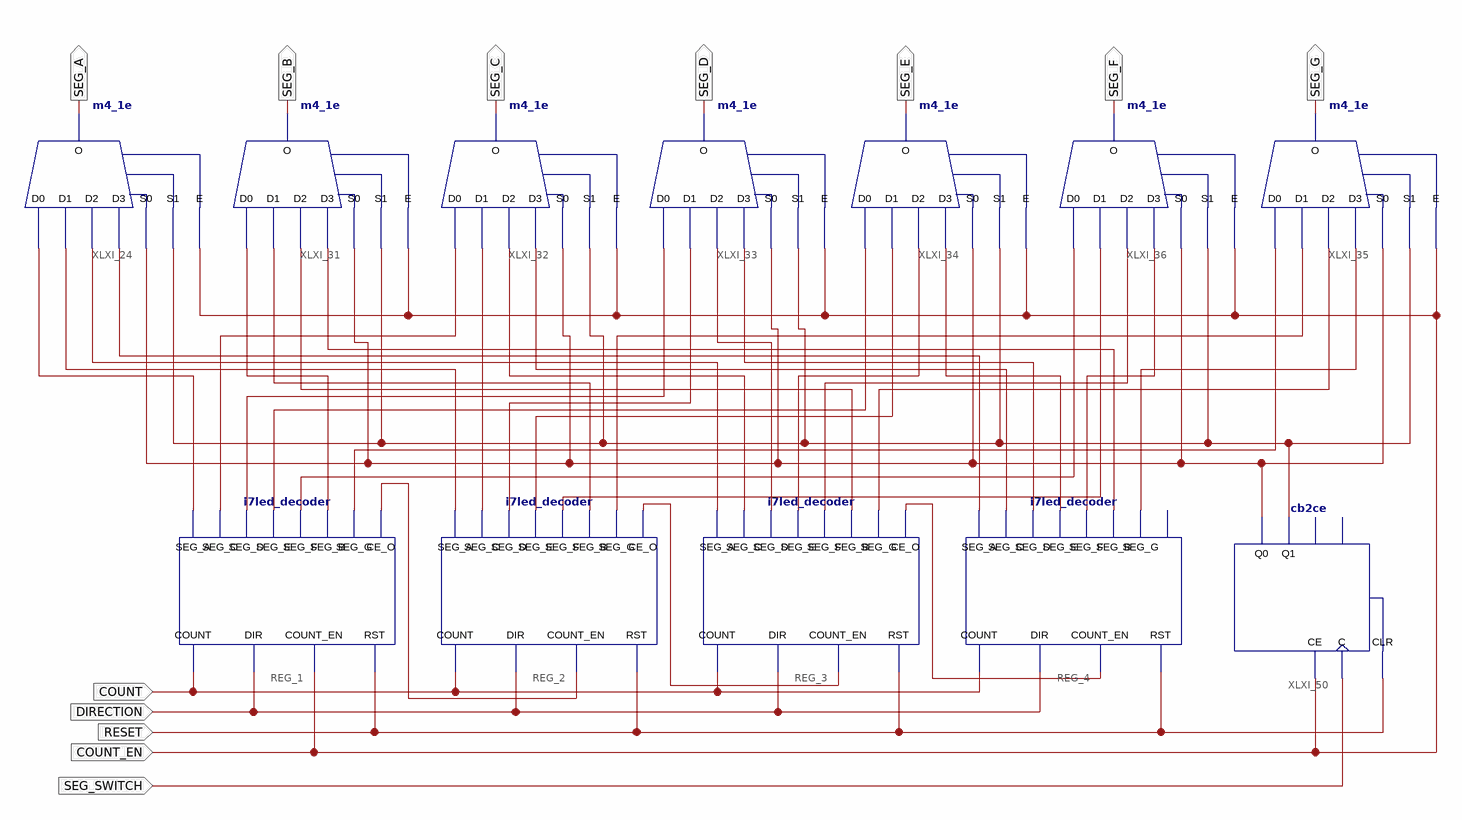
[diagram p0: schematic sheet 1]
// Xilinx ISE schematic indic_4reg_decoder.sch (spartan6) as structural Verilog: 12 symbols, 12 ports
module indic_4reg_decoder (
  input  DIRECTION,
  input  COUNT,
  input  RESET,
  input  COUNT_EN,
  input  SEG_SWITCH,
  output SEG_A,
  output SEG_B,
  output SEG_C,
  output SEG_D,
  output SEG_E,
  output SEG_F,
  output SEG_G
);

  wire XLXN_63, XLXN_65, XLXN_71, XLXN_84, XLXN_85, XLXN_86, XLXN_87, XLXN_88, XLXN_89, XLXN_90, XLXN_91,
       XLXN_92, XLXN_93, XLXN_94, XLXN_95, XLXN_96, XLXN_97, XLXN_98, XLXN_99, XLXN_100, XLXN_101, XLXN_102,
       XLXN_103, XLXN_104, XLXN_105, XLXN_106, XLXN_107, XLXN_108, XLXN_109, XLXN_110, XLXN_111, XLXN_112,
       XLXN_113;

  i7led_decoder REG_1 (
    .COUNT(COUNT), .DIR(DIRECTION), .COUNT_EN(COUNT_EN), .RST(RESET), .SEG_A(XLXN_86), .SEG_C(XLXN_94),
    .SEG_D(XLXN_98), .SEG_E(XLXN_102), .SEG_F(XLXN_106), .SEG_B(XLXN_90), .SEG_G(XLXN_110), .CE_O(XLXN_63));
  i7led_decoder REG_2 (
    .COUNT(COUNT), .DIR(DIRECTION), .COUNT_EN(XLXN_63), .RST(RESET), .SEG_A(XLXN_87), .SEG_C(XLXN_95),
    .SEG_D(XLXN_99), .SEG_E(XLXN_103), .SEG_F(XLXN_107), .SEG_B(XLXN_91), .SEG_G(XLXN_111), .CE_O(XLXN_65));
  i7led_decoder REG_3 (
    .COUNT(COUNT), .DIR(DIRECTION), .COUNT_EN(XLXN_65), .RST(RESET), .SEG_A(XLXN_88), .SEG_C(XLXN_96),
    .SEG_D(XLXN_100), .SEG_E(XLXN_104), .SEG_F(XLXN_108), .SEG_B(XLXN_92), .SEG_G(XLXN_112), .CE_O(XLXN_71));
  i7led_decoder REG_4 (
    .COUNT(COUNT), .DIR(DIRECTION), .COUNT_EN(XLXN_71), .RST(RESET), .SEG_A(XLXN_89), .SEG_C(XLXN_97),
    .SEG_D(XLXN_101), .SEG_E(XLXN_105), .SEG_F(XLXN_109), .SEG_B(XLXN_93), .SEG_G(XLXN_113));  // open: CE_O
  m4_1e XLXI_35 (
    .D0(XLXN_110), .D1(XLXN_111), .D2(XLXN_112), .D3(XLXN_113), .E(COUNT_EN), .S0(XLXN_84), .S1(XLXN_85),
    .O(SEG_G));
  m4_1e XLXI_24 (
    .D0(XLXN_86), .D1(XLXN_87), .D2(XLXN_88), .D3(XLXN_89), .E(COUNT_EN), .S0(XLXN_84), .S1(XLXN_85),
    .O(SEG_A));
  m4_1e XLXI_31 (
    .D0(XLXN_90), .D1(XLXN_91), .D2(XLXN_92), .D3(XLXN_93), .E(COUNT_EN), .S0(XLXN_84), .S1(XLXN_85),
    .O(SEG_B));
  m4_1e XLXI_32 (
    .D0(XLXN_94), .D1(XLXN_95), .D2(XLXN_96), .D3(XLXN_97), .E(COUNT_EN), .S0(XLXN_84), .S1(XLXN_85),
    .O(SEG_C));
  m4_1e XLXI_33 (
    .D0(XLXN_98), .D1(XLXN_99), .D2(XLXN_100), .D3(XLXN_101), .E(COUNT_EN), .S0(XLXN_84), .S1(XLXN_85),
    .O(SEG_D));
  m4_1e XLXI_34 (
    .D0(XLXN_102), .D1(XLXN_103), .D2(XLXN_104), .D3(XLXN_105), .E(COUNT_EN), .S0(XLXN_84), .S1(XLXN_85),
    .O(SEG_E));
  m4_1e XLXI_36 (
    .D0(XLXN_106), .D1(XLXN_107), .D2(XLXN_108), .D3(XLXN_109), .E(COUNT_EN), .S0(XLXN_84), .S1(XLXN_85),
    .O(SEG_F));
  cb2ce XLXI_50 (.C(SEG_SWITCH), .CE(COUNT_EN), .CLR(RESET), .Q0(XLXN_84), .Q1(XLXN_85));  // open: CEO, TC
endmodule
